# Altium schematic sheet Cable.SchDoc
size A3
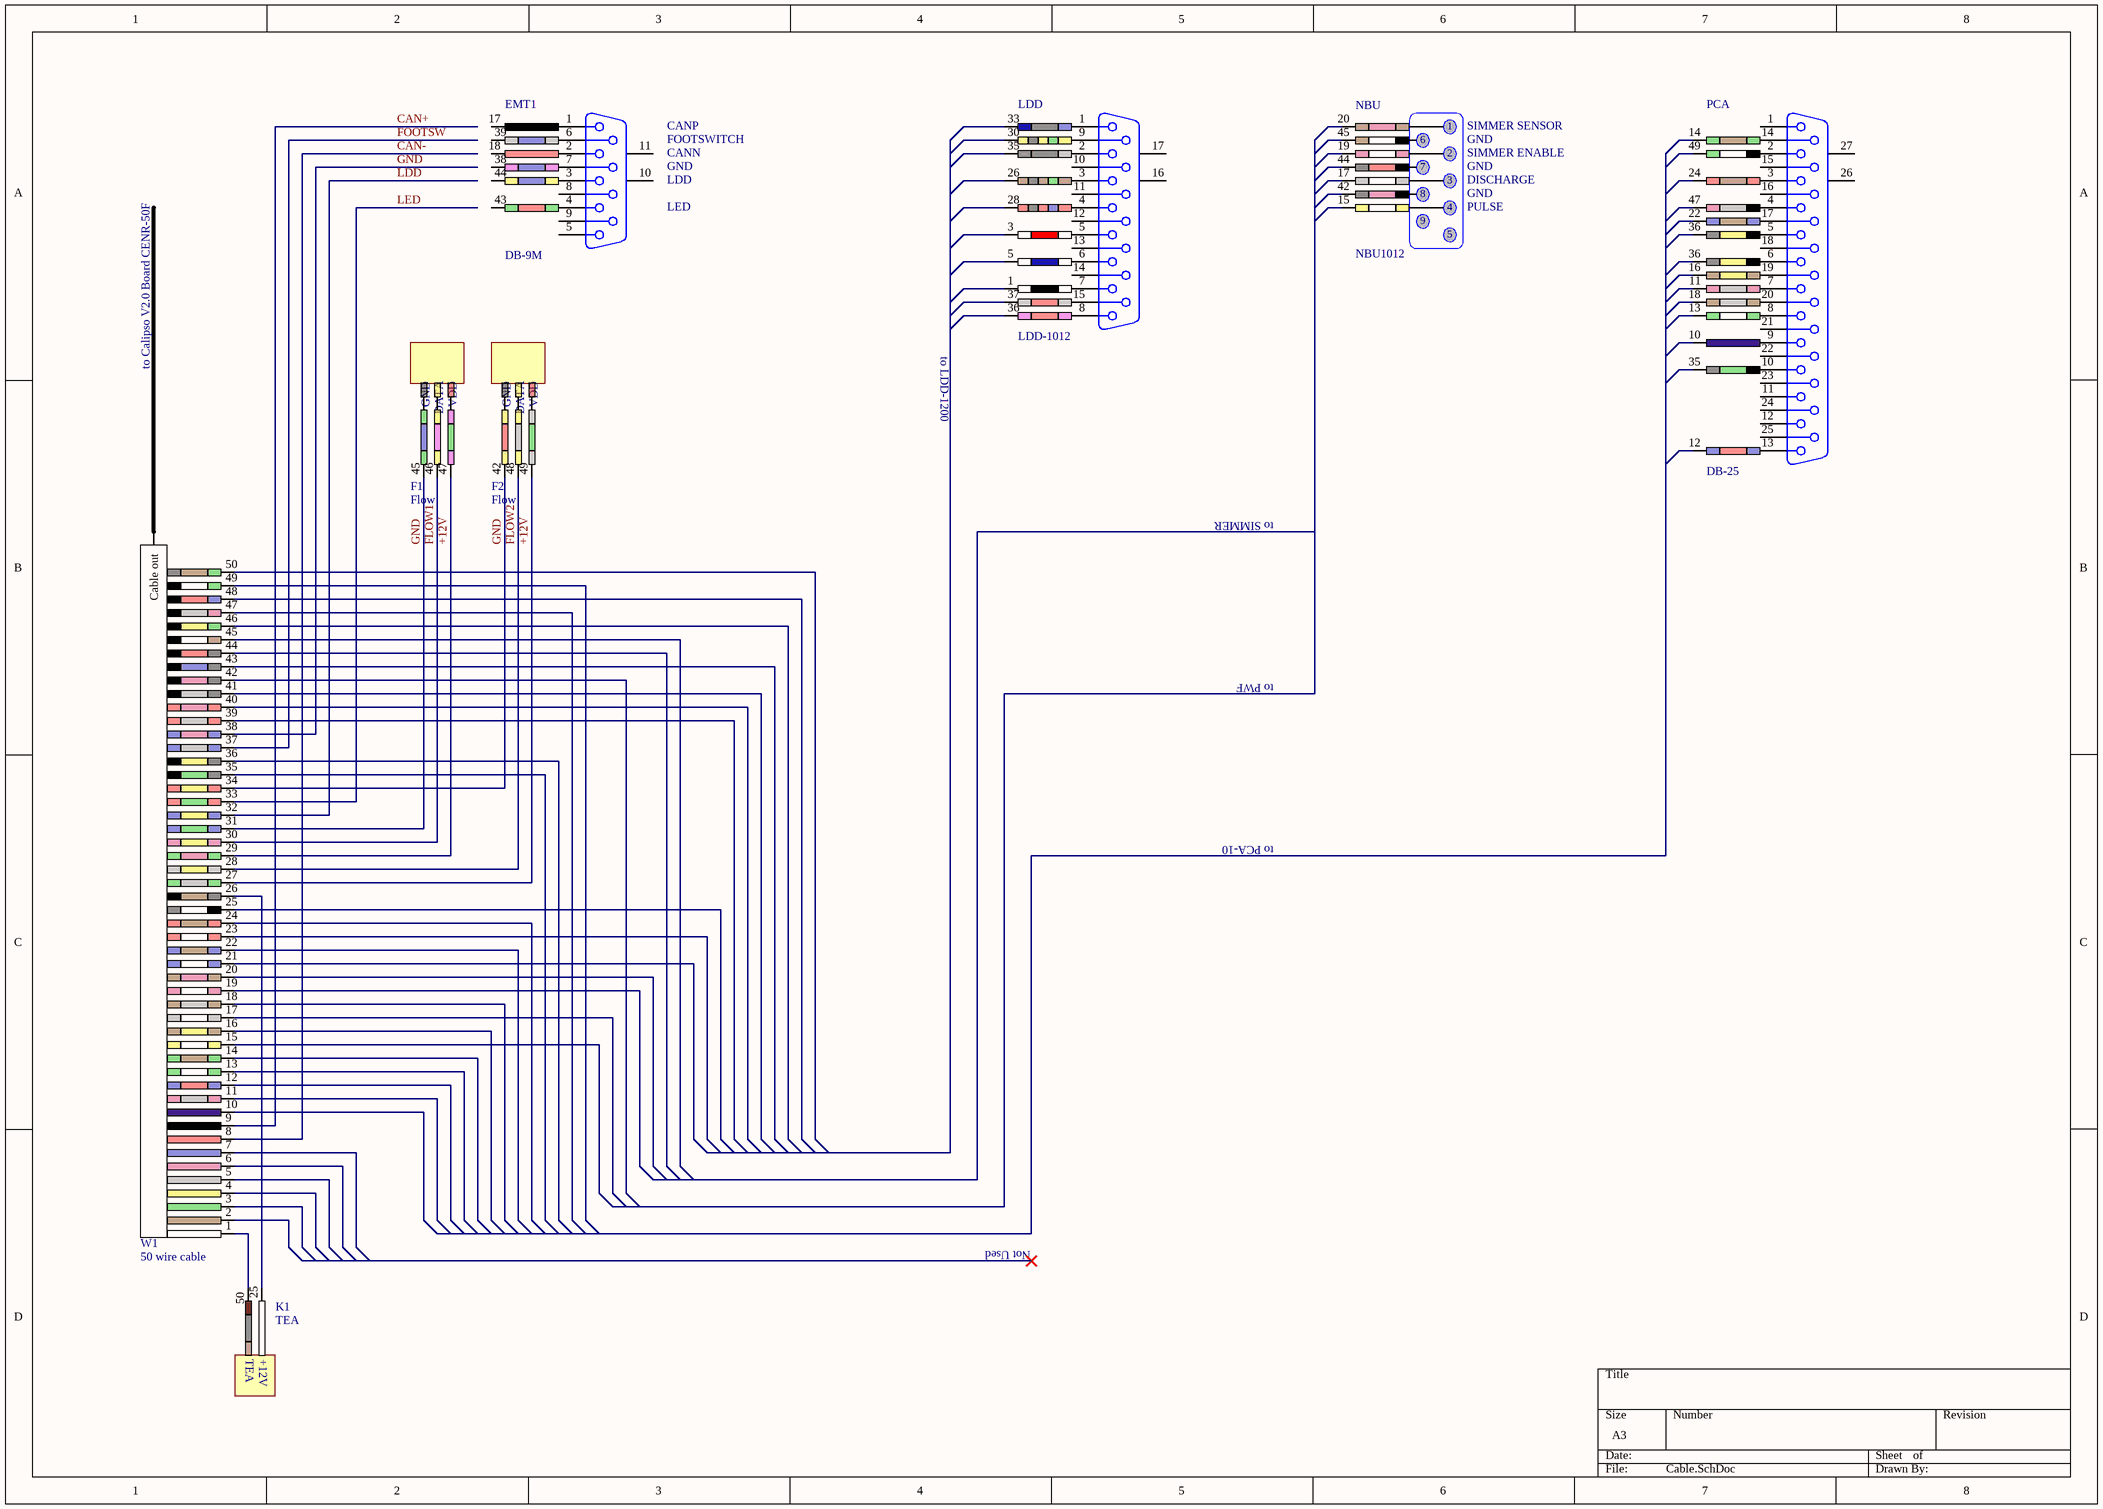
[diagram p0: Cable.SchDoc]

## Parts
EMT1  DB-9M
F1  Flow
F2  Flow
K1  TEA
LDD  LDD-1012
NBU  NBU1012
PCA  DB-25
W1  50 wire cable

## Nets
+12V: W1.27 W1.29
CAN+: W1.9
CAN-: W1.8
FLOW1: W1.30
FLOW2: W1.28
FOOTSW: W1.37
GND: W1.31 W1.34 W1.38
LDD: W1.32
LED: W1.33
NetK1_25: K1.25 W1.26

Not connected (* = marked no-connect by the designer): EMT1 1 2 3 4 5 6 7 8 9 10(MH1) 11(MH2) 17 18 38 39 43 44; F1 45 46 47; F2 42 48 49; K1 50; LDD 1 2 3 4 5 6 7 8 9 10 11 12 13 14 15 16(MH1) 17(MH2) 26 28 30 33 35 36 37; NBU 15 17 19 20 42 44 45; PCA 1 2 3 4 5 6 7 8 9 10 11 12 13 14 15 16 17 18 19 20 21 22 23 24 25 26(MH1) 27(MH2) 35 36 47 49; W1 1 2 3 4 5 6 7 10 11 12 13 14 15 16 17 18 19 20 21 22 23 24 25 35 36 39 40 41 42 43 44 45 46 47 48 49 50 51(Cable_out)

## Notes on the sheet
- to Calipso V2.0 Board CENR-50F
- to LDD-1200
- to SIMMER
- to PWF
- to PCA-10
- Not Used
- (in symbol Emmiter) CANP; FOOTSWITCH; CANN; GND; LDD; LED
- (in symbol Flow Sensor) GND; DATA; VDD
- (in symbol Flow Sensor 2) GND; DATA; VDD
- (in symbol NBU) 1; SIMMER SENSOR; 6; GND; 2; SIMMER ENABLE; 7; 3; DISCHARGE; 8; 4; PULSE; 9; 5
- (in symbol TEA) +12V

## Library data of the parts
EMT1 = Emmiter
F1 = Flow Sensor
F2 = Flow Sensor 2
K1 = TEA: Termo electrical assembly
NBU = NBU
PCA = PCA-10_1
W1 = Cable-50wire